# Altium schematic sheet CLOCKS.SCHDOC
size A; DocumentNumber: 4; SheetNumber: 4; SheetTotal: 5
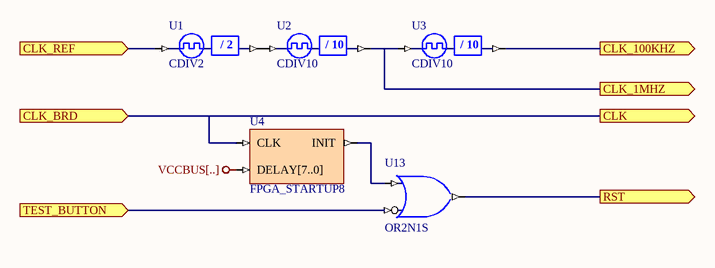
[diagram p0: CLOCKS.SCHDOC]

## Parts
U1  CDIV2
U2  CDIV10
U3  CDIV10
U4  FPGA_STARTUP8
U13  OR2N1S

## Ports
CLK (out), CLK_1MHZ (out), CLK_100KHZ (out), CLK_BRD (in), CLK_REF (in), RST (out), TEST_BUTTON (in)

## Nets
VCCBUS[..]: U4.DELAY[7..0]
CLK: U4.CLK ; port CLK_BRD, port CLK
CLK_1MHZ: U2.CLKDV U3.CLKIN ; port CLK_1MHZ
CLK_100KHZ: U3.CLKDV ; port CLK_100KHZ
CLK_REF: U1.CLKIN ; port CLK_REF
RST: U13.O ; port RST
TEST_BUTTON: U13.I0 ; port TEST_BUTTON
NetU1_CLKDV: U1.CLKDV U2.CLKIN
NetU4_INIT: U4.INIT U13.I1

## Notes on the sheet
- (in symbol CDIV2) / 2
- (in symbol CDIV10) / 10

## Library data of the parts
U1 = CDIV2: Clock Divider by 2; ArchiveName: GENERIC; Published: 7-Nov-2003; Publisher: Altium Limited; Core Revision: 1.00.00
U2 U3 = CDIV10: Clock Divider by 10; Xilinx Equivalent: CLK_DIV10; ArchiveName: GENERIC; Published: 18-Sep-2003; Publisher: Altium Limited; Class I: Clock Divider
U4 = FPGA_STARTUP8: FPGA Startup With 8 Bit Delay; Published: 21/01/2004; Publisher: Altium Hobart Technology Centre; Core Revision: 1.00.00
U13 = OR2N1S: 2-Input OR Gate with Active Low A Input, Single Pin Version; Xilinx Equivalent: OR2B1; ArchiveName: GENERIC; Published: 18-Dec-2003; Publisher: Altium Limited; Core Revision: 1.00.00